# Altium schematic sheet Sheet_1_2021-12-20.schdoc
size 58 x 32 mm
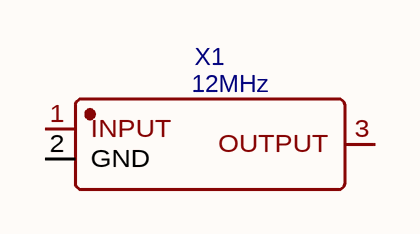
[diagram p0: Sheet_1_2021-12-20.schdoc]

## Parts
X1  12MHz  [CRYSTAL-SMD_3P-L3.2-W1.3-P1.2-BL]

## Nets

Not connected (* = marked no-connect by the designer): X1 1(INPUT) 2(GND) 3(OUTPUT)

## Library data of the parts
X1 = 12MHz: BOM_Manufacturer: muRata(村田); BOM_Manufacturer Part: CSTNE12M0G52A000R0; nameAlias: Frequency; Contributor: LCSC; BOM_Supplier: LCSC; BOM_Supplier Part: C907957; BOM_JLCPCB Part Class: Extended Part; spicePre: X; spiceSymbolName: CSTNE12M0G52A000R0